# EAGLE design HM-MOIST (EAGLE 9.6.0)
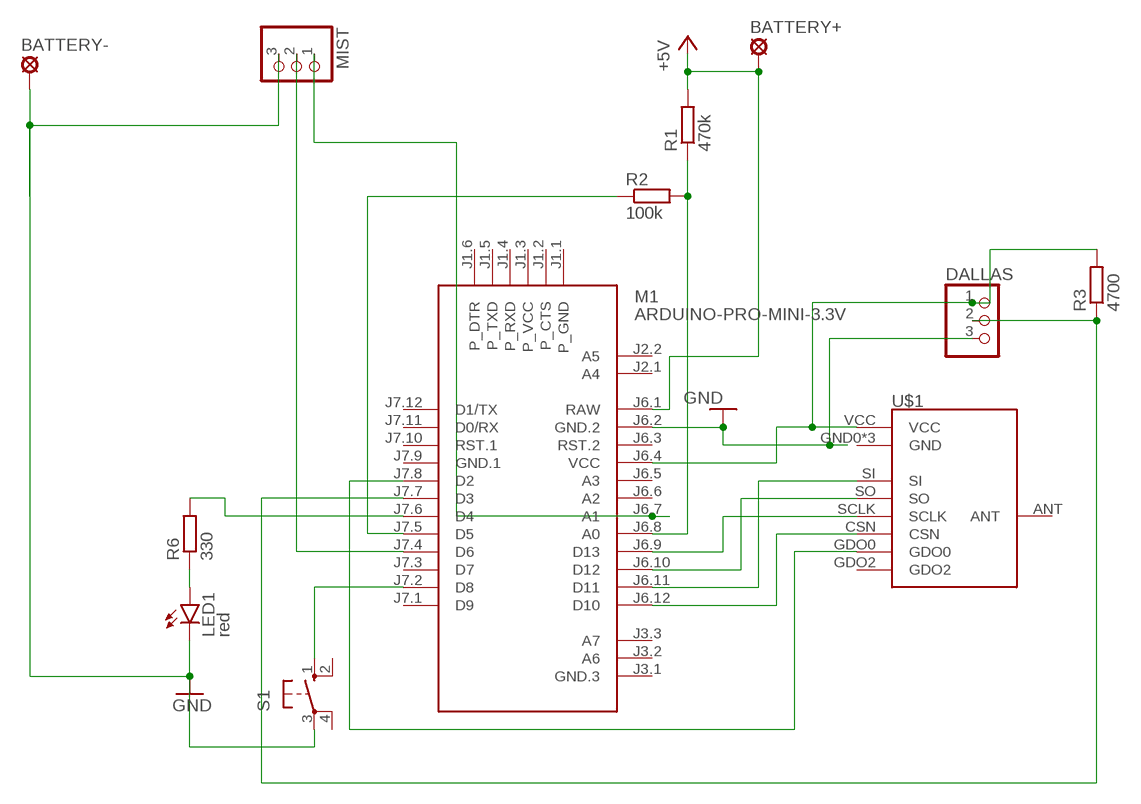
[diagram p0: schematic, sheet 1]

## Parts
BATTERY+  LSP11  [LSP11]
BATTERY-  LSP11  [LSP11]
DALLAS  PINHD-1X3  [1X03]
LED1  red  LED5MM  [LED5MM]
M1  ARDUINO-PRO-MINI-3.3V  [ARDUINO-PRO-MINI]
MIST  PINHD-1X3  [1X03]
R1  470k  R-EU_M1206  [M1206]
R2  100k  R-EU_0204/7  [0204/7]
R3  4700  R-EU_0204/7  [0204/7]
R6  330  R-EU_M1206  [M1206]
S1  10-XX  [B3F-10XX]
U$1  CC1101  [CC1101]

## Nets
+5V: BATTERY+.MP M1.J6.1(RAW) R1.2
GND: BATTERY-.MP DALLAS.3 LED1.K(C) M1.J6.2(GND.2) MIST.3 S1.3(P)
N$1: M1.J6.12(D10) U$1.CSN
N$2: M1.J7.8(D2) U$1.GDO0
N$3: M1.J6.11(D11) U$1.SI
N$4: M1.J6.10(D12) U$1.SO
N$5: M1.J6.9(D13) U$1.SCLK
N$7: LED1.A R6.1
N$8: M1.J7.2(D8) S1.1(S)
N$9: M1.J7.6(D4) R6.2
N$10: M1.J6.8(A0) R1.1 R2.2
N$11: DALLAS.1 M1.J6.4(VCC) R3.2 U$1.VCC
N$12: M1.J7.5(D5) R2.1
N$13: M1.J7.4(D6) MIST.2
N$14: DALLAS.2 M1.J7.7(D3) R3.1
N$15: M1.J6.7(A1) MIST.1
Unconnected: M1.J1.1(P_GND) M1.J1.2(P_CTS) M1.J1.3(P_VCC) M1.J1.4(P_RXD) M1.J1.5(P_TXD) M1.J1.6(P_DTR) M1.J2.1(A4) M1.J2.2(A5) M1.J3.1(GND.3) M1.J3.2(A6) M1.J3.3(A7) M1.J6.3(RST.2) M1.J6.5(A3) M1.J6.6(A2) M1.J7.1(D9) M1.J7.3(D7) M1.J7.10(RST.1) M1.J7.11(D0/RX) M1.J7.12(D1/TX) S1.2(S1) S1.4(P1) U$1.ANT U$1.GDO2

## Power pins joined to a net without a drawn wire
GND: U$1.GND0(GND) U$1.GND1(GND) U$1.GND2(GND)
GND.1: M1.J7.9(GND.1)

## Library data of the parts
BATTERY+ BATTERY- = solpad:LSP11: SOLDER PAD drill 1.1 mm
DALLAS MIST = pinhead:PINHD-1X3: PIN HEADER
LED1 = led:LED: LED OSRAM: - CHIPLED LG R971, LG N971, LY N971, LG Q971, LY Q971, LO R971, LY R971 LH N974, LH R974 LS Q976, LO Q976, LY Q976 LO Q996 - Hyper CHIPLED LW Q18S LB Q993, LB Q99A, LB R99A - SideLED LS A670, LO A670, LY A670, LG A670, LP A670 LB A673, LV A673, LT A673, LW A673 LH A674 LY A675 LS A676, LA A676, LO A676, LY A676, LW A676 LS A679, LY A679, LG A679 - Hyper Micro SIDELED® LS Y876, LA Y876, LO Y876, LY Y876 LT Y87S - SmartLED LW L88C, LW L88S LB L89C, LB L89S, LG L890 LS L89K, LO L89K, LY L89K LS L896, LA L896, LO L896, LY L896 - TOPLED LS T670, LO T670, LY T670, LG T670, LP T670 LSG T670, LSP T670, LSY T670, LOP T670, LYG T670 LG T671, LOG T671, LSG T671 LB T673, LV T673, LT T673, LW T673 LH T674 LS T676, LA T676, LO T676, LY T676, LB T676, LH T676, LSB T676, LW T676 LB T67C, LV T67C, LT T67C, LS T67K, LO T67K, LY T67K, LW E67C LS E67B, LA E67B, LO E67B, LY E67B, LB E67C, LV E67C, LT E67C LW T67C LS T679, LY T679, LG T679 LS T770, LO T770, LY T770, LG T770, LP T770 LB T773, LV T773, LT T773, LW T773 LH T774 LS E675, LA E675, LY E675, LS T675 LS T776, LA T776, LO T776, LY T776, LB T776 LHGB T686 LT T68C, LB T68C - Hyper Mini TOPLED® LB M676 - Mini TOPLED Santana® LG M470 LS M47K, LO M47K, LY M47K Source: http://www.osram.convergy.de LUXEON: - LUMILED® LXK2-PW12-R00, LXK2-PW12-S00, LXK2-PW14-U00, LXK2-PW14-V00 LXK2-PM12-R00, LXK2-PM12-S00, LXK2-PM14-U00 LXK2-PE12-Q00, LXK2-PE12-R00, LXK2-PE12-S00, LXK2-PE14-T00, LXK2-PE14-U00 LXK2-PB12-K00, LXK2-PB12-L00, LXK2-PB12-M00, LXK2-PB14-N00, LXK2-PB14-P00, LXK2-PB14-Q00 LXK2-PR12-L00, LXK2-PR12-M00, LXK2-PR14-Q00, LXK2-PR14-R00 LXK2-PD12-Q00, LXK2-PD12-R00, LXK2-PD12-S00 LXK2-PH12-R00, LXK2-PH12-S00 LXK2-PL12-P00, LXK2-PL12-Q00, LXK2-PL12-R00 Source: www.luxeon.com KINGBRIGHT: KA-3528ASYC Source: www.kingbright.com
M1 = diy-modules:ARDUINO-PRO-MINI-*: Arduino Pro Mini and compatible devices More details available here: https://www.arduino.cc/en/Main/ArduinoBoardProMini Click here to find device on ebay.com <http://www.ebay.com/sch/arduino+pro+mini>
R1-R3 R6 = rcl:R-EU_: RESISTOR, European symbol; SPICEPREFIX: R
S1 = switch-omron:10-XX: OMRON SWITCH; MPN: B3F-1000; OC_FARNELL: 176432; OC_NEWARK: 36M3542
U$1 = modules:CC1101

## Board
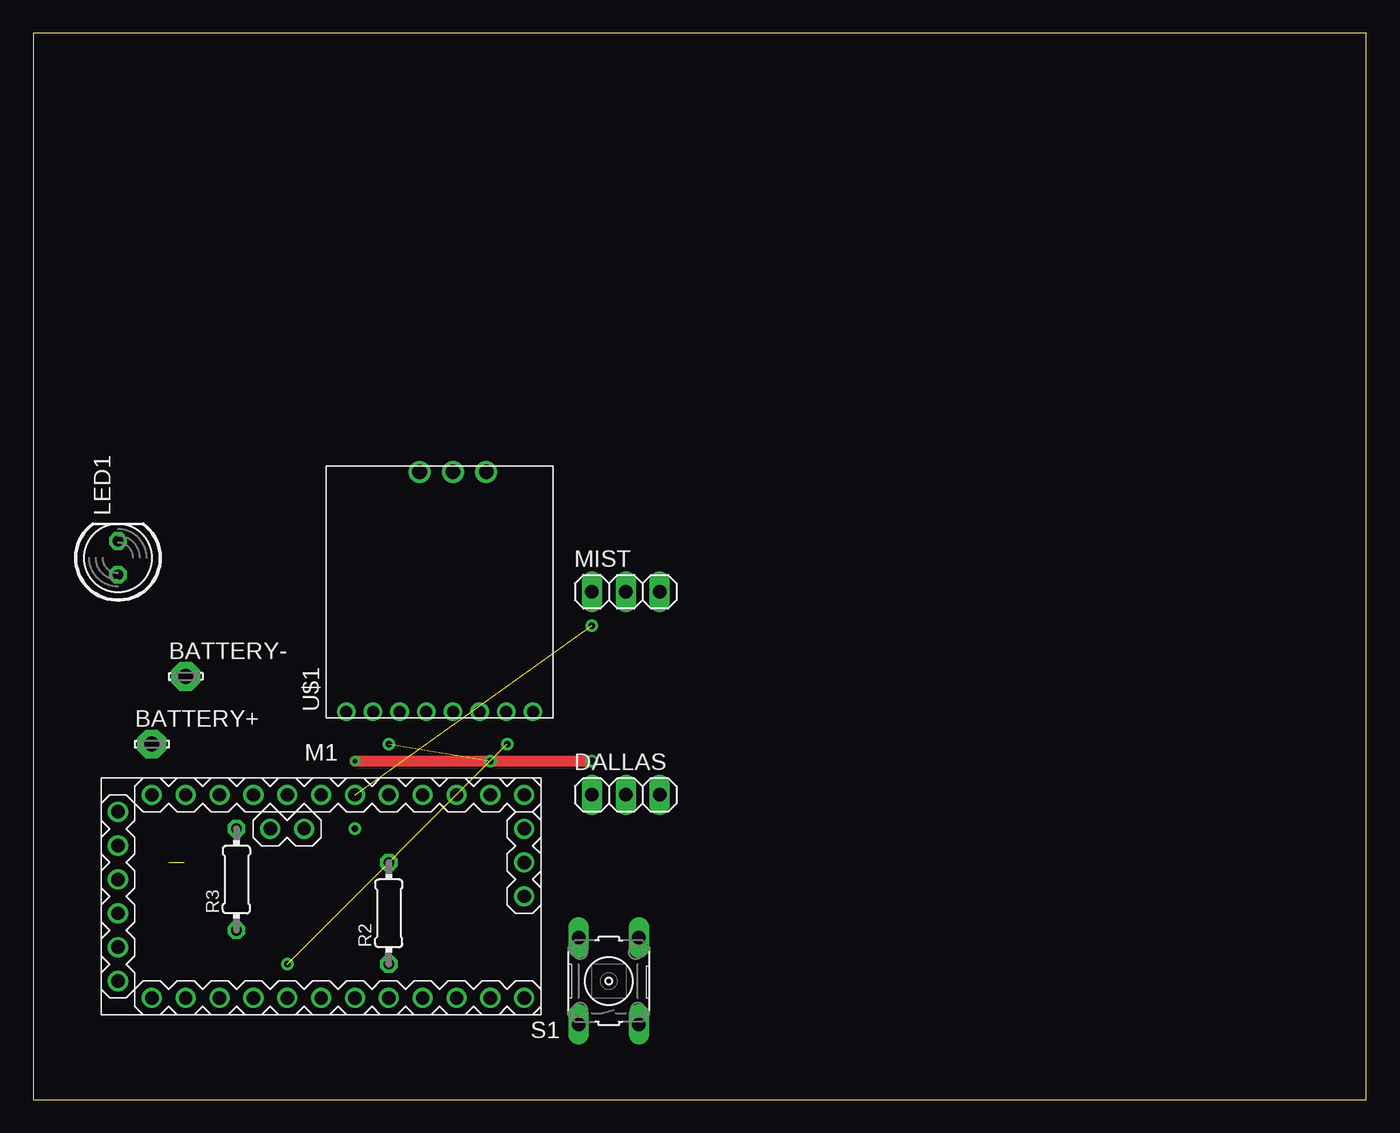
[diagram p1: board, top side]
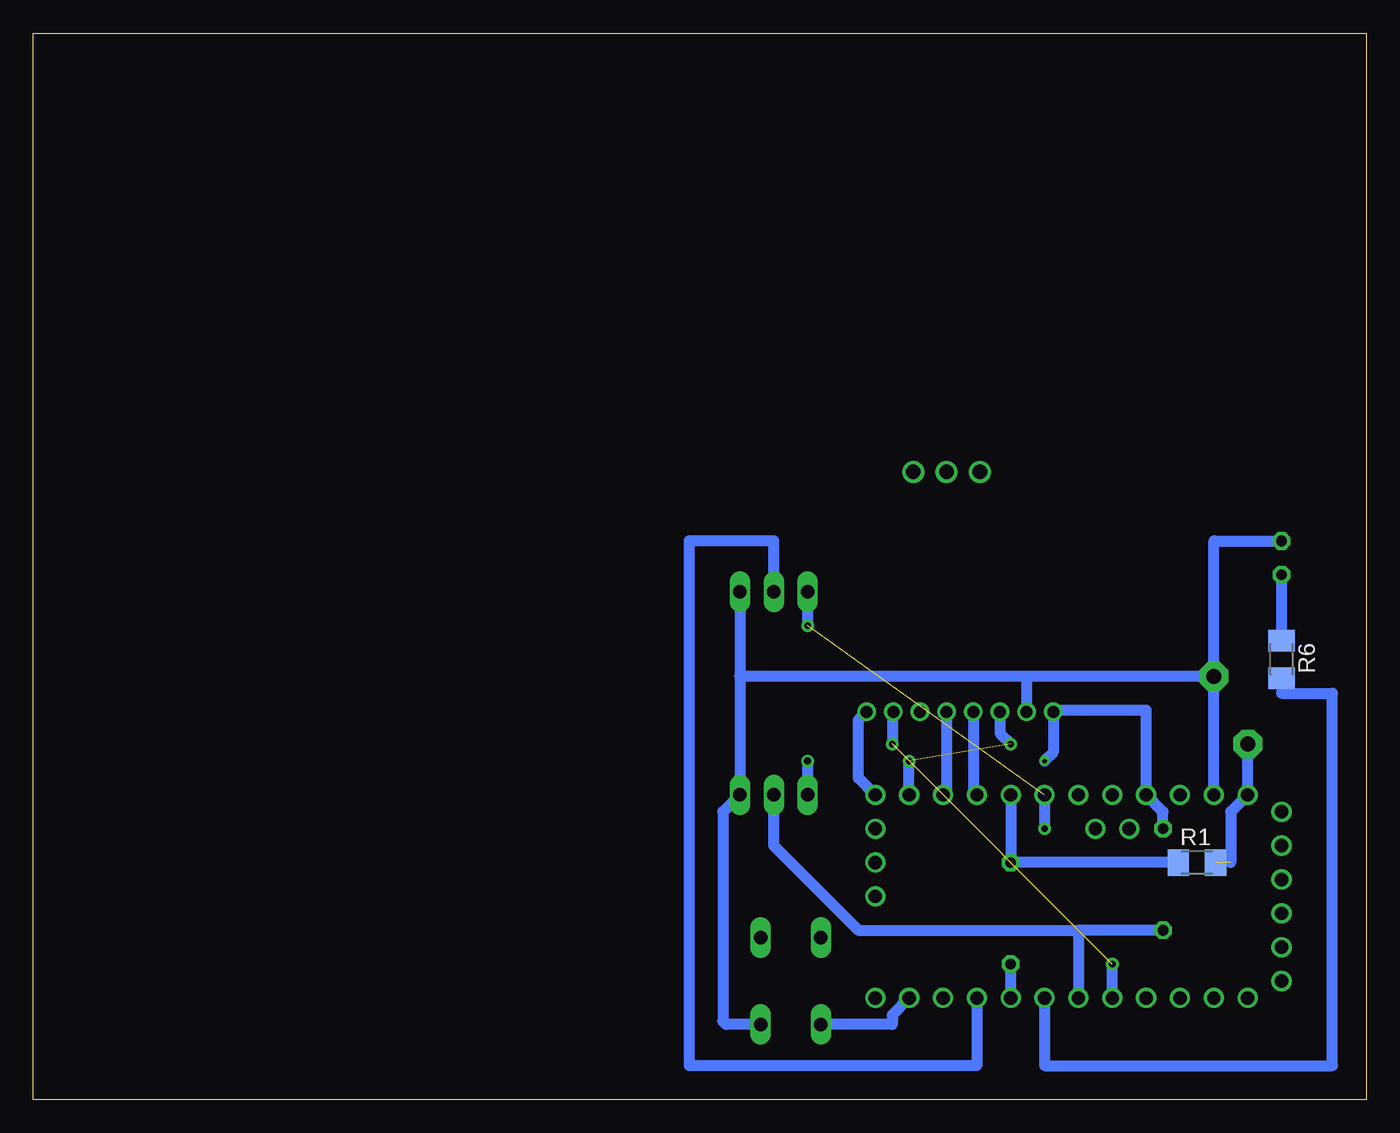
[diagram p2: board, bottom side, seen from below]

Size 100 x 80 mm. Coordinates in mm from the lower left corner, seen from the top.
Outline: 0,0 100,0 100,80 0,80 0,0
Copper layers (1*16): Top 0.035mm / dielectric 1.5mm / Bottom 0.035mm
Design rules "default": minimum track width 6mil, minimum drill 0.35mm, track to track 6mil, track to pad 6mil, pad to pad 6mil, via to via 6mil, smd to smd 6mil, copper to edge 40mil, drill to drill 6mil, minimum pad ring 10mil, minimum via ring 8mil, stop-mask expansion 4mil, vias tented up to drill 0mil, thermal gap 10mil

### Footprints (pad centres in the part's own frame; a part is rotated, then mirrored left to right if it is on the bottom)
LSP11 = drill 1.118 pad 2.159 octagon: MP 0,0
1X03 = drill 1.016 long: 1 -2.54,0; 2 0,0; 3 2.54,0
LED5MM = drill 0.813 octagon: A -1.27,0; K 1.27,0
ARDUINO-PRO-MINI = drill 1: J1.1 -15.24,6.35; J1.2 -15.24,3.81; J1.3 -15.24,1.27; J1.4 -15.24,-1.27; J1.5 -15.24,-3.81; J1.6 -15.24,-6.35; J2.1 -1.27,5.08; J2.2 -3.81,5.08; J3.1 15.24,0; J3.2 15.24,2.54; J3.3 15.24,5.08; J6.1 -12.7,7.62; J6.2 -10.16,7.62; J6.3 -7.62,7.62; J6.4 -5.08,7.62; J6.5 -2.54,7.62; J6.6 0,7.62; J6.7 2.54,7.62; J6.8 5.08,7.62; J6.9 7.62,7.62; J6.10 10.16,7.62; J6.11 12.7,7.62; J6.12 15.24,7.62; J7.1 15.24,-7.62; J7.2 12.7,-7.62; J7.3 10.16,-7.62; J7.4 7.62,-7.62; J7.5 5.08,-7.62; J7.6 2.54,-7.62; J7.7 0,-7.62; J7.8 -2.54,-7.62; J7.9 -5.08,-7.62; J7.10 -7.62,-7.62; J7.11 -10.16,-7.62; J7.12 -12.7,-7.62
M1206 = smd 1.6 x 2: 1 -1.4,0; 2 1.4,0
0204/7 = drill 0.813 octagon: 1 -3.81,0; 2 3.81,0
B3F-10XX = drill 1.016 long: 1 -3.251,2.261; 2 3.251,2.261; 3 -3.251,-2.261; 4 3.251,-2.261
CC1101 = drill 1.1: ANT 9,-1; GND1 9,-3.5; GND2 9,1.5 | drill 0.9: CSN -9,-7; GDO0 -9,-5; GDO2 -9,-3; GND0 -9,5; SCLK -9,1; SI -9,3; SO -9,-1; VCC -9,7

### Placement (x,y rotation side)
BATTERY+  8.89,26.67 0 top
BATTERY-  11.43,31.75 0 top
DALLAS  44.45,22.86 0 top
LED1  6.35,40.64 90 top
M1  21.59,15.24 0 top
MIST  44.45,38.1 0 top
R1  12.7,17.78 0 bottom
R2  26.67,13.97 90 top
R3  15.24,16.51 90 top
R6  6.35,33.02 270 bottom
S1  43.18,8.89 90 top
U$1  30.48,38.1 90 top

### Tracks (layer width: path | path; a pad name or v marks a point on that pad's centre or on a via)
+5V  (1 unrouted)
  Bottom 0.813: BATTERY+.MP M1.J6.1 10.16,21.59 10.16,17.78
GND
  Bottom 0.813: M1.J6.2 BATTERY-.MP | BATTERY-.MP 25.4,31.75 | 25.4,31.75 25.48,31.67 U$1.GND0 | BATTERY-.MP 11.43,41.91 LED1.K | S1.3 48.02,5.64 48.26,5.88 48.26,21.59 DALLAS.3 46.99,31.75 | MIST.3 46.99,31.75 | 25.4,31.75 46.99,31.75
N$1
  Bottom 0.813: 37.48,23.51 M1.J6.12 38.1,24.13 38.1,28.48 U$1.CSN
N$2  (via drill 0.5 pad 0.95)  (1 unrouted)
  Bottom 0.813: M1.J7.8 19.05,10.16 | U$1.GDO0 35.56,29.02 v35.56,26.67
N$3  (1 unrouted)
  Bottom 0.813: U$1.SI 27.48,27.48 26.67,26.67 | M1.J6.11 34.29,25.4
N$4
  Bottom 0.813: U$1.SO 31.48,23.13 M1.J6.10
N$5
  Bottom 0.813: U$1.SCLK 29.48,23.13 M1.J6.9
N$6  (via drill 0.5 pad 0.95)
  other vias: 26.67,26.67
N$7
  Bottom 0.813: R6.1 LED1.A
N$8
  Bottom 0.813: M1.J7.2 35.56,6.35 35.56,5.64 S1.1
N$9
  Bottom 0.813: M1.J7.6 24.13,2.54 2.54,2.54 2.54,30.48 6.35,30.48 R6.2
N$10
  Bottom 0.813: M1.J6.8 R2.2 R1.1
N$11  (via drill 0.35, 0.53)
  Top 0.813: v24.13,25.4 v41.91,25.4
  Bottom 0.813: R3.2 15.24,21.59 M1.J6.4 16.51,29.21 23.37,29.21 U$1.VCC 23.48,26.05 v24.13,25.4 | v41.91,25.4 DALLAS.1
N$12
  Bottom 0.813: M1.J7.5 R2.1
N$13
  Bottom 0.813: M1.J7.4 29.21,2.54 50.8,2.54 50.8,41.91 44.45,41.91 MIST.2
N$14
  Bottom 0.813: R3.1 21.59,12.7 | 21.59,12.7 M1.J7.7 | 21.59,12.7 38.1,12.7 44.45,19.05 DALLAS.2
N$15  (1 unrouted)
  Bottom 0.813: M1.J6.7 24.13,20.32 | MIST.1 41.91,35.56
N$16  (via drill 0.5 pad 0.95)
  other vias: 34.29,25.4
N$17  (via drill 0.5 pad 0.95)
  other vias: 19.05,10.16
N$18  (via drill 0.5 pad 0.95)
  other vias: 24.13,20.32
N$19  (via drill 0.5 pad 0.95)
  other vias: 41.91,35.56